# EAGLE design circuit_design (EAGLE 8.6.1)
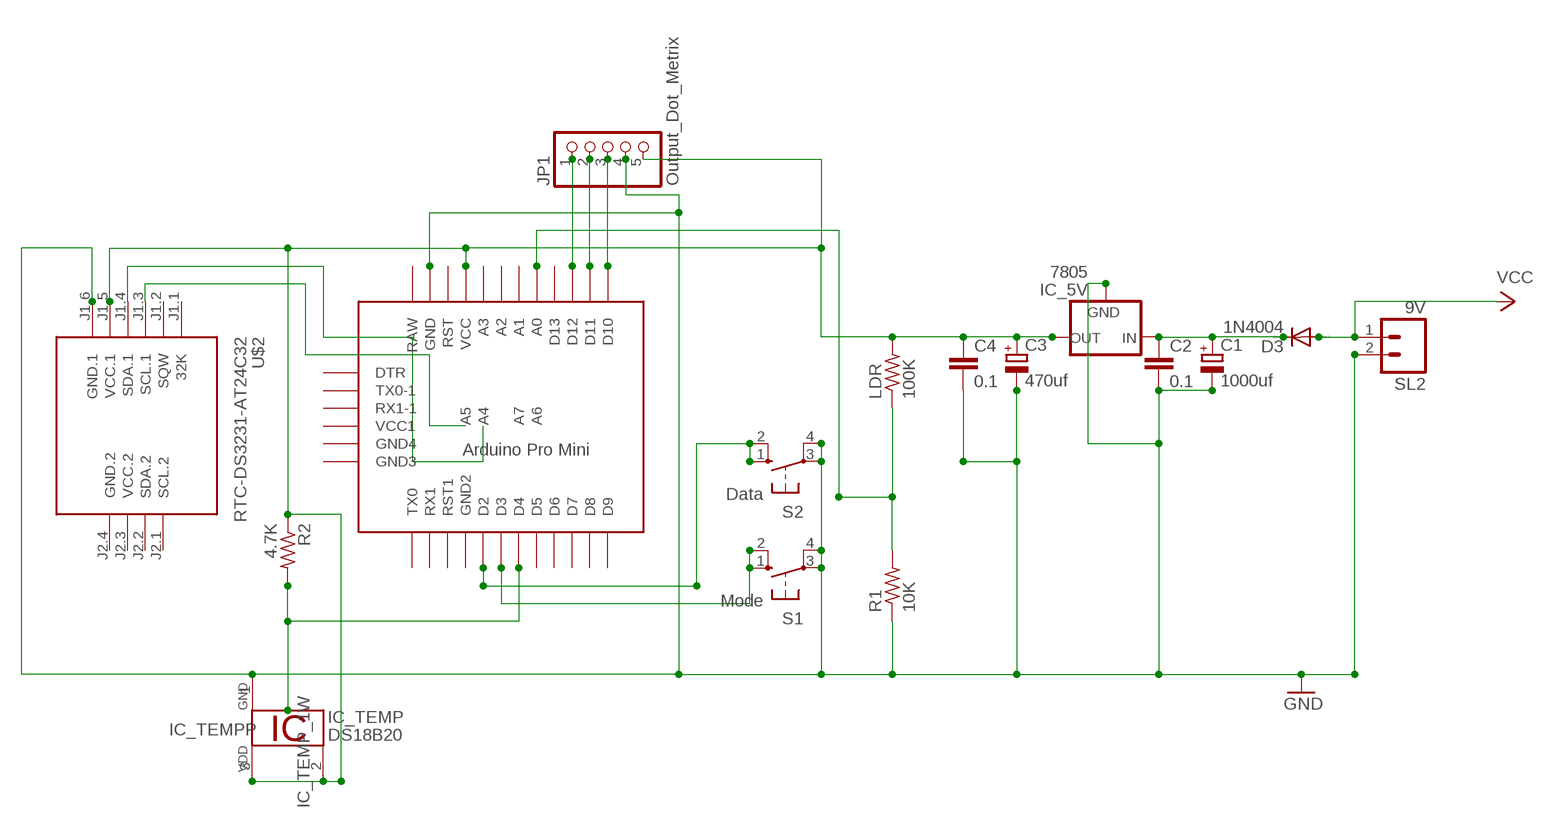
[diagram p0: schematic, sheet 1]

## Parts
C1  1000uf  CPOL-EUE2,5-6E  [E2,5-6E]
C2  0.1  C-EU025-024X044  [C025-024X044]
C3  470uf  CPOL-EUE2,5-6E  [E2,5-6E]
C4  0.1  C-EU025-024X044  [C025-024X044]
D3  1N4004  [DO41-10]
IC_5V  7805  78XXS  [78XXS]
IC_TEMP  DS18B20  [TO92-]
JP1  Output_Dot_Metrix  PINHD-1X5  [1X05]
LDR  100K  R-US_V526-0  [V526-0]
R1  10K  R-US_0309/12  [0309/12]
R2  4.7K  R-US_0309/12  [0309/12]
S1  Mode  10-XX  [B3F-10XX]
S2  Data  10-XX  [B3F-10XX]
SL2  9V  M02  [02P]
U$1  PRO-MINI-2  [PRO-MINI-2]
U$2  RTC-DS3231-AT24C32  [RTC-DS3231-AT24C32]

## Nets
GND: C1.- C2.2 C3.- C4.2 IC_5V.GND IC_TEMP.1 JP1.4 R1.1 S1.3(P) S1.4(P1) S2.3(P) S2.4(P1) SL2.2 U$1.GND U$2.J1.6(GND.1)
N$1: C1.+ C2.1 D3.C IC_5V.IN
N$3: C3.+ C4.1 IC_5V.OUT IC_TEMP.2 IC_TEMP.3 JP1.5 LDR.2 R2.1 U$1.VCC U$2.J1.5(VCC.1)
N$5: S2.1(S) S2.2(S1) U$1.D2
N$6: LDR.1 R1.2 U$1.A0
N$7: S1.1(S) S1.2(S1) U$1.D3
N$8: R2.2 U$1.D4
N$9: U$2.J1.4(SDA.1)
N$10: U$2.J1.3(SCL.1)
N$11: JP1.1 U$1.D12
N$12: JP1.2 U$1.D11
N$13: JP1.3 U$1.D10
VCC: D3.A SL2.1
Unconnected: U$1.A1 U$1.A2 U$1.A3 U$1.A4 U$1.A5 U$1.A6 U$1.A7 U$1.D5 U$1.D6 U$1.D7 U$1.D8 U$1.D9 U$1.D13 U$1.DTR U$1.GND1(GND2) U$1.GND2(GND3) U$1.GND3(GND4) U$1.RAW U$1.RST U$1.RST1 U$1.RX1 U$1.RX1-1 U$1.TX0 U$1.TX0-1 U$1.VCC1 U$2.J1.1(32K) U$2.J1.2(SQW) U$2.J2.1(SCL.2) U$2.J2.2(SDA.2)

## Power pins joined to a net without a drawn wire
GND.2: U$2.J2.4(GND.2)
VCC.2: U$2.J2.3(VCC.2)

## Library data of the parts
C1 C3 = rcl:CPOL-EU: POLARIZED CAPACITOR, European symbol
C2 C4 = rcl:C-EU: CAPACITOR, European symbol
D3 = diode:1N4004: DIODE general purpose rectifier, 1 A
IC_5V = v-reg:78XXS: VOLTAGE REGULATOR
IC_TEMP = 1wire:DS18B20: Programmable Resolution Digital Thermometer This chip provides a onewire thermosensor with approx. 0.5°C accuracy. A programmable over/undertemperure alarm is available. The precision can be set from 9..12 bits. Notes: Vdd must be applied for accurate measurements at low temperatures, as the parasite power circuit otherwise heats the sensor. If parasite power is used, Vdd has to be connected to GND. The DS1822 is a low-cost thermometer chip, the DS18S20 is similar to the DS18B20, but with 9 Bit precision only. Author: Jan Kandziora <jjj@gmx.de>
JP1 = pinhead:PINHD-1X5: PIN HEADER
LDR = rcl:R-US_: RESISTOR, American symbol; SPICEPREFIX: R
R1 R2 = rcl:R-US_: RESISTOR, American symbol
S1 S2 = switch-omron:10-XX: OMRON SWITCH; MPN: B3F-1000; OC_FARNELL: 176432; OC_NEWARK: 36M3542
SL2 = con-amp-quick:M02: AMP QUICK CONNECTOR; OC_FARNELL: unknown; OC_NEWARK: unknown
U$1 = Arduino-clone:PRO-MINI-2: Arduino Pro Mini Layout 2 Sparkfun.com
U$2 = diy-modules:RTC-DS3231-AT24C32: RTC Module with Battery and EEPROM based on DS3231 and AT24C32 chips Tutorial can be found here: https://edwardmallon.wordpress.com/2014/05/21/using-a-cheap-3-ds3231-rtc-at24c32-eeprom-from-ebay/ Click here to find device on ebay.com <http://www.ebay.com/sch/DS3231+AT24C32+module>

## Board
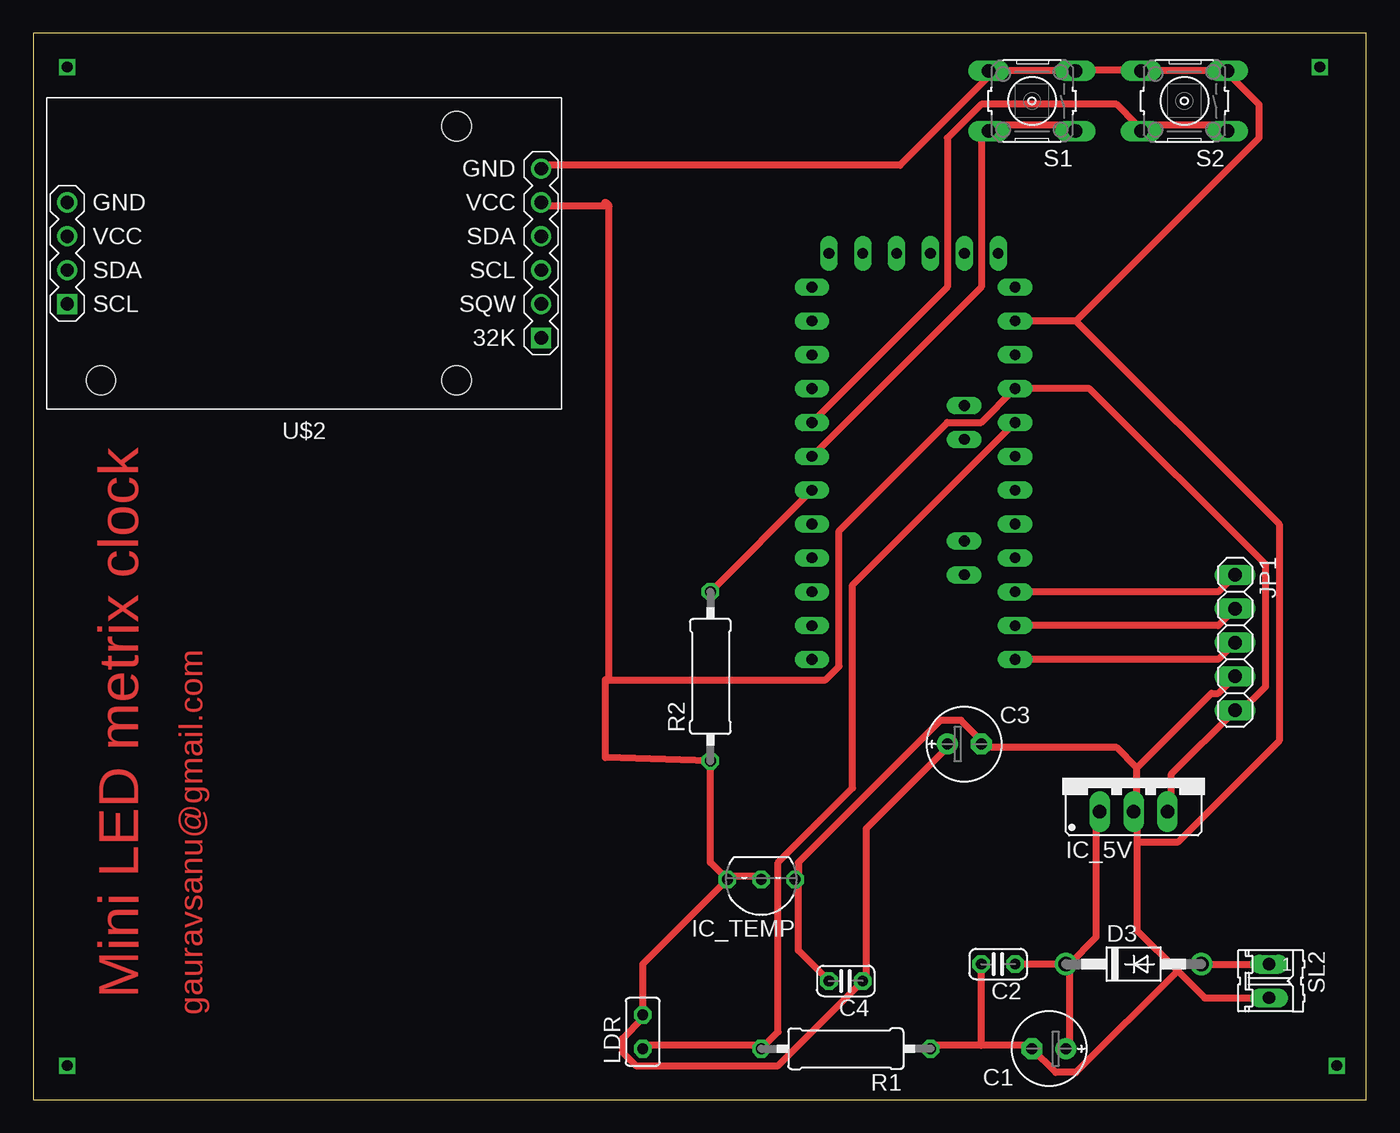
[diagram p1: board, top side]

Size 100 x 80 mm. Coordinates in mm from the lower left corner, seen from the top.
Outline: 0,0 100,0 100,80 0,80 0,0
Copper layers (1*16): Top 0.035mm / dielectric 1.5mm / Bottom 0.035mm
Design rules "default *": minimum track width 20mil, minimum drill 0.5mm, track to track 20mil, track to pad 10mil, pad to pad 6mil, via to via 6mil, smd to smd 6mil, copper to edge 40mil, drill to drill 6mil, minimum pad ring 10mil, minimum via ring 8mil, stop-mask expansion 4mil, vias tented up to drill 0mil, thermal gap 10mil

### Footprints (pad centres in the part's own frame; a part is rotated, then mirrored left to right if it is on the bottom)
E2,5-6E = drill 0.813 pad 1.575: + -1.27,0 | drill 0.813 pad 1.575 octagon: - 1.27,0
C025-024X044 = drill 0.813 octagon: 1 -1.27,0; 2 1.27,0
DO41-10 = drill 1.118: A 5.08,0; C -5.08,0
78XXS = drill 1.016 long: GND 0,-2.54; IN -2.54,-2.54; OUT 2.54,-2.54
TO92- = drill 0.813 octagon: 1 -2.54,0; 2 0,0; 3 2.54,0
1X05 = drill 1.016 long: 1 -5.08,0; 2 -2.54,0; 3 0,0; 4 2.54,0; 5 5.08,0
V526-0 = drill 0.813 octagon: 1 -1.27,0; 2 1.27,0
0309/12 = drill 0.813 octagon: 1 -6.35,0; 2 6.35,0
B3F-10XX = drill 1.016 long: 1 -3.251,2.261; 2 3.251,2.261; 3 -3.251,-2.261; 4 3.251,-2.261
02P = drill 0.914 long: 1 -1.27,0; 2 1.27,0
PRO-MINI-2 = drill 0.8 long: A0 6.35,2.54; A1 6.35,0; A2 6.35,-2.54; A3 6.35,-5.08; A4 2.54,1.27; A5 2.54,3.81; A6 2.54,-8.89; A7 2.54,-6.35; D2 -8.89,2.54; D3 -8.89,0; D4 -8.89,-2.54; D5 -8.89,-5.08; D6 -8.89,-7.62; D7 -8.89,-10.16; D8 -8.89,-12.7; D9 -8.89,-15.24; D10 6.35,-15.24; D11 6.35,-12.7; D12 6.35,-10.16; D13 6.35,-7.62; DTR 5.08,15.24; GND 6.35,10.16; GND1 -8.89,5.08; GND2 -7.62,15.24; GND3 -5.08,15.24; RAW 6.35,12.7; RST 6.35,7.62; RST1 -8.89,7.62; RX1 -8.89,10.16; RX1-1 0,15.24; TX0 -8.89,12.7; TX0-1 2.54,15.24; VCC 6.35,5.08; VCC1 -2.54,15.24
RTC-DS3231-AT24C32 = drill 1 square: J1.1 -17.78,6.35; J2.1 17.78,3.81 | drill 1: J1.2 -17.78,3.81; J1.3 -17.78,1.27; J1.4 -17.78,-1.27; J1.5 -17.78,-3.81; J1.6 -17.78,-6.35; J2.2 17.78,1.27; J2.3 17.78,-1.27; J2.4 17.78,-3.81 | hole 2.2: -11.43,-9.525; -11.43,9.525; 15.24,9.525

### Placement (x,y rotation side)
C1  76.2,3.81 180 top
C2  72.39,10.16 180 top
C3  69.85,26.67 0 top
C4  60.96,8.89 180 top
D3  82.55,10.16 0 top
DRILEGEND  [DRILEGEND]  -5,-7.87 0 top  (outside the outline)
IC_5V  82.55,24.13 0 top
IC_TEMP  54.61,16.51 180 top
JP1  90.17,34.29 270 top
LDR  45.72,5.08 90 top
R1  60.96,3.81 180 top
R2  50.8,31.75 90 top
S1  74.93,74.93 180 top
S2  86.36,74.93 180 top
SL2  92.71,8.89 270 top
U$1  67.31,48.26 0 top
U$2  20.32,63.5 180 top

### Tracks (layer width: path | path; a pad name or v marks a point on that pad's centre or on a via)
GND
  Top 0.508: 71.12,4.06 74.68,4.06 C1.- 76.71,2.03 78.23,2.03 85.85,9.65 | 71.12,4.06 67.56,4.06 R1.1 | 71.12,4.06 C2.2 | C4.2 57.4,11.18 57.4,16.26 IC_TEMP.1 57.4,16.76 57.4,17.78 68.07,28.45 69.6,28.45 71.12,26.92 C3.- 71.12,26.42 81.28,26.42 82.8,24.89 | SL2.2 87.88,7.62 85.85,9.65 | 85.85,9.65 82.8,12.7 82.8,19.3 | 82.8,19.3 82.8,21.34 IC_5V.GND 82.8,21.84 82.8,24.89 | JP1.4 88.9,30.48 88.39,30.48 82.8,24.89 | 78.23,58.42 U$1.GND | 78.23,58.42 91.95,72.14 91.95,74.68 89.92,76.71 S2.3 89.41,77.22 83.31,77.22 S2.4 82.8,77.22 78.23,77.22 S1.3 77.72,77.22 72.14,77.22 S1.4 71.63,76.71 65.02,70.1 38.1,70.1 U$2.J1.6 | 82.8,19.3 85.85,19.3 93.47,26.92 93.47,43.18 78.23,58.42
N$1
  Top 0.508: C2.1 D3.C 77.72,10.16 | 77.72,10.16 79.76,12.19 79.76,21.34 IC_5V.IN | 77.72,10.16 77.72,4.06 C1.+
N$2  (via drill 0.8 pad 1.05)
  other vias: 2.54,2.54
N$3
  Top 0.508: IC_5V.OUT 85.34,21.84 85.34,24.38 JP1.5 90.42,28.96 92.46,30.99 92.46,40.13 79.25,53.34 U$1.VCC 71.12,50.8 68.58,50.8 60.45,42.67 60.45,32.51 59.44,31.5 43.18,31.5 | C3.+ 68.58,26.42 62.48,20.32 62.48,9.14 C4.1 55.88,2.54 45.21,2.54 44.2,3.56 44.2,4.57 45.72,6.1 LDR.2 45.72,10.16 IC_TEMP.3 | IC_TEMP.2 54.36,16.76 52.32,16.76 IC_TEMP.3 | IC_TEMP.3 50.8,17.78 R2.1 42.93,25.65 42.93,31.5 43.18,31.5 | 42.86,67.31 arc-79 43.17,67.06 | 43.17,67.06 arc-11 43.18,66.99 | 43.18,67.06 38.1,67.06 U$2.J1.5 | 43.18,31.5 43.18,67.06 | 43.18,67.06 43.17,67.06
N$4  (via drill 0.8 pad 1.05)
  other vias: 97.79,2.54
N$5
  Top 0.508: U$1.D2 68.58,60.96 68.58,72.14 71.12,74.68 81.28,74.68 82.8,73.15 S2.2 83.31,73.15 89.41,73.15 S2.1
N$6
  Top 0.508: U$1.A0 61.47,38.61 61.47,23.37 55.88,17.78 55.88,5.08 R1.2 54.36,4.06 45.72,4.06 LDR.1
N$7
  Top 0.508: U$1.D3 71.12,60.96 71.12,72.14 71.63,72.64 S1.2 72.14,73.15 77.72,73.15 S1.1
N$8
  Top 0.508: R2.2 U$1.D4
N$11
  Top 0.508: U$1.D12 88.9,38.1 JP1.1
N$12
  Top 0.508: U$1.D11 88.9,35.56 JP1.2
N$13
  Top 0.508: U$1.D10 88.9,33.02 JP1.3
N$14  (via drill 0.8 pad 1.05)
  other vias: 96.52,77.47
N$15  (via drill 0.8 pad 1.05)
  other vias: 2.54,77.47
VCC
  Top 0.508: D3.A SL2.1

### Text on the board
Top: Mini LED metrix clock | gauravsanu@gmail.com
DrillLegend: LAYER-STACK
DrillLegend_01-16: 01-16
DrillLegend_01-20: 01-20